# Altium schematic sheet STM32F103C8T6.SchDoc
size A4
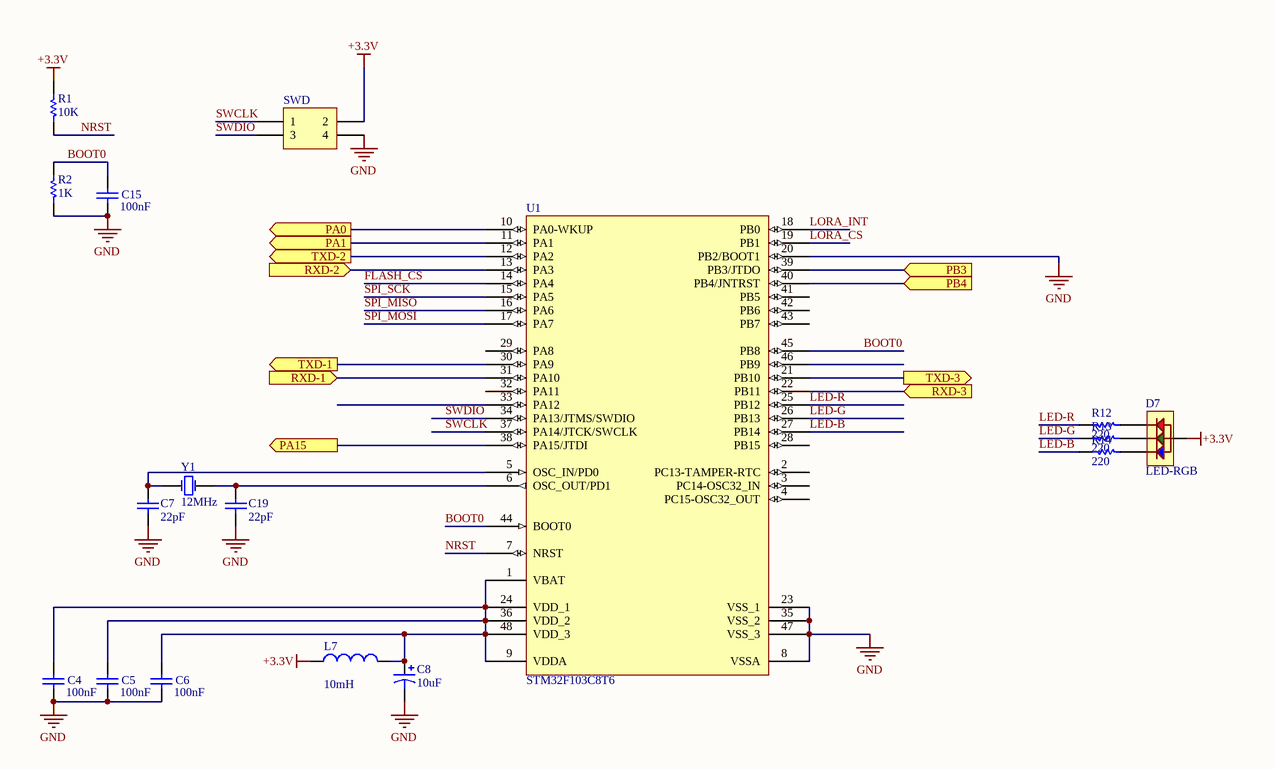
[diagram p0: STM32F103C8T6.SchDoc]

## Parts
C4  100nF  [C603]
C5  100nF  [C603]
C6  100nF  [C603]
C7  22pF  [C603]
C8  10uF  [c805]
C15  100nF  [C603]
C19  22pF  [C603]
D7  LED-RGB  [LED-1210]
L7  value 10mH  [R805]  (hidden comment: Inductor)
R1  10K  [R0603]
R2  1K  [R0603]
R12  220  [R0603]
R13  220  [R0603]
R14  220  [R0603]
SWD  MHDR2X2  [PHDR-2MM-2X2]  (value not drawn)
U1  STM32F103C8T6  [LQFP-48]
Y1  12MHz  [XTAL-SMD]

## Ports
PA0 (out), PA1 (out), PA15 (out), PB3 (in), PB4 (in), RXD-1 (in), RXD-2 (in), RXD-3 (in), TXD-1 (out), TXD-2 (out), TXD-3 (out)

## Nets
+3.3V: D7.4(COM) L7.1 R1.2 SWD.2
GND: C4.1 C5.1 C6.1 C7.2 C8.2 C15.1 C19.2 R2.1 SWD.4 U1.8(VSSA) U1.20(PB2/BOOT1) U1.23(VSS_1) U1.35(VSS_2) U1.47(VSS_3)
BOOT0: C15.2 R2.2 U1.44(BOOT0) U1.45(PB8)
FLASH_CS: U1.14(PA4)
LED-B: R14.2 U1.27(PB14)
LED-G: R13.2 U1.26(PB13)
LED-R: R12.2 U1.25(PB12)
LORA_CS: U1.19(PB1)
LORA_INT: U1.18(PB0)
NRST: R1.1 U1.7(NRST)
PA0: U1.10(PA0-WKUP) ; port PA0
PA1: U1.11(PA1) ; port PA1
PA15: U1.38(PA15/JTDI) ; port PA15
PB3: U1.39(PB3/JTDO) ; port PB3
PB4: U1.40(PB4/JNTRST) ; port PB4
RXD-1: U1.31(PA10) ; port RXD-1
RXD-2: U1.13(PA3) ; port RXD-2
RXD-3: U1.22(PB11) ; port RXD-3
SPI_MISO: U1.16(PA6)
SPI_MOSI: U1.17(PA7)
SPI_SCK: U1.15(PA5)
SWCLK: SWD.1 U1.37(PA14/JTCK/SWCLK)
SWDIO: SWD.3 U1.34(PA13/JTMS/SWDIO)
TXD-1: U1.30(PA9) ; port TXD-1
TXD-2: U1.12(PA2) ; port TXD-2
TXD-3: U1.21(PB10) ; port TXD-3
NetC4_2: C4.2 C5.2 C6.2 C8.1 L7.2 U1.1(VBAT) U1.9(VDDA) U1.24(VDD_1) U1.36(VDD_2) U1.48(VDD_3)
NetC7_1: C7.1 U1.5(OSC_IN/PD0) Y1.1(OSC1)
NetC19_1: C19.1 U1.6(OSC_OUT/PD1) Y1.2(OSC2)
NetD7_1: D7.1(B) R14.1
NetD7_2: D7.2(G) R13.1
NetD7_3: D7.3(R) R12.1

Not connected (* = marked no-connect by the designer): U1 2(PC13-TAMPER-RTC) 3(PC14-OSC32_IN) 4(PC15-OSC32_OUT) 28(PB15) 29(PA8) 32(PA11) 33(PA12) 41(PB5) 42(PB6) 43(PB7) 46(PB9)

## Notes on the sheet
- Title
- Size:
- Date:
- A4
- Number:
- Time:
- Revision:
- Sheet
- of
- Atrotech co.
- www.atrotech.ir
- +98 90 369 22 999
- Tehran
- IRAN
- File:

## Library data of the parts
C4-C7 C15 C19 = Cap: Capacitor; Designer: Parsa Malekpour
  C4-C6 C15: Value: 100nF
  C7 C19: Value: 22pF
C8 = CAP-POL: Polar Capacitor; Voltage: 10V; Value: 10uF
D7 = LED-RGB-1210
L7 = Inductor: Code_IEC: 1005; Published: 8-Jun-2000; LatestRevisionDate: 29-May-2009; LatestRevisionNote: IPC-7351 Footprint Added.; PackageReference: 0402-A; Publisher: Altium Limited; PackageDescription: Chip Inductor; Code_JEITA: 0402
R1 R2 R12-R14 = Resistor: Designer: Parsa Malekpour
  R1: Value: 10K
  R2: Value: 1K
  R12-R14: Value: 220
SWD = MHDR2X2: Header, 2-Pin, Dual row; LatestRevisionDate: 17-Jul-2002; LatestRevisionNote: Re-released for DXP Platform.; Publisher: Altium Limited
U1 = STM32F103C8T6: STM32 ARM-based 32-bit MCU with 64 Kbytes Flash, 48-pin LQFP, Industrial Temperature; Published: 30-May-2008; DatasheetVersion: rev6, Mar-2008; PackageVersion: Mar-2008; PackageReference: LQFP48; Publisher: Altium Limited; PackageDescription: 48-Pin Low-Profile Quad Flat Pack, 7 x 7 mm Body, 0.5 mm Pitch (LQFP48); ComponentLink1Description: Manufacturer Link; ComponentLink1URL: www.st.com/stm32; ComponentLink2Description: Datasheet; ComponentLink2URL: http://www.st.com/stonline/products/literature/ds/13587.pdf
Y1 = XTAL: Crystal Oscillator; Designer: Parsa Malekpour; Email: Malekpour.parsa@Gmail.com; Value: 12MHz